# EAGLE design winglet (EAGLE 8.7.1)
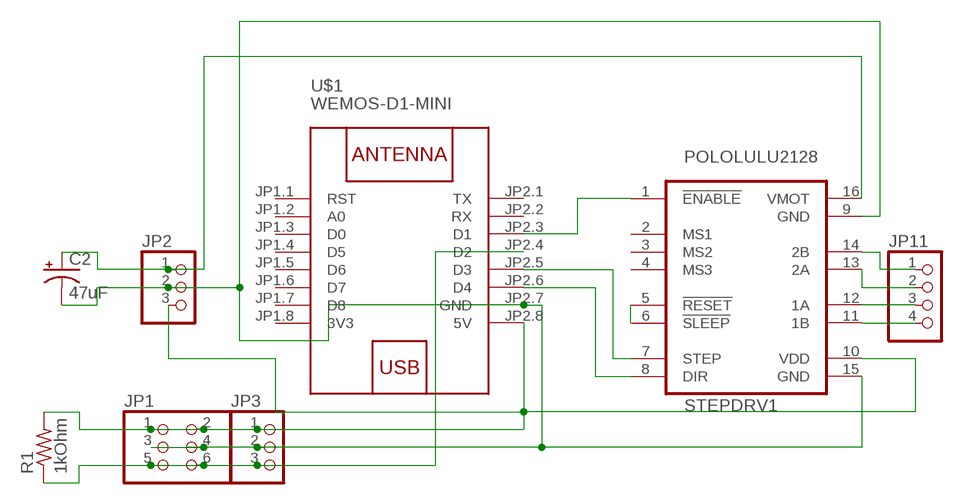
[diagram p0: schematic, sheet 1]

## Parts
C2  47uF  47UF-POLAR-PANASONIC_D-35V-20%  [PANASONIC_D]
JP1  PINHD-2X3  [2X03]
JP2  PINHD-1X3/90  [1X03/90]
JP3  PINHD-1X3  [1X03]
JP11  PINHD-1X4/90  [1X04/90]
R1  1kOhm  R-US_M1206  [M1206]
STEPDRV1  POLOLULU2128  [POLOLULU2128]
U$1  WEMOS-D1-MINI  [WEMOS-D1-MINI]

## Nets
N$1: JP1.1 JP1.2 JP2.3 JP3.1 R1.2 STEPDRV1.10(VDD) U$1.JP2.8(5V)
N$2: C2.- JP1.3 JP1.4 JP2.2 JP3.2 STEPDRV1.9(GND) STEPDRV1.15(GND) U$1.JP2.7(GND)
N$3: JP1.5 JP1.6 JP3.3 R1.1 U$1.JP2.4(D2)
N$4: STEPDRV1.5(!RESET) STEPDRV1.6(!SLEEP)
N$5: STEPDRV1.1(!ENABLE) U$1.JP2.3(D1)
N$6: STEPDRV1.7(STEP) U$1.JP2.5(D3)
N$7: C2.+ JP2.1 STEPDRV1.16(VMOT)
N$8: STEPDRV1.8(DIR) U$1.JP2.6(D4)
N$9: JP11.4 STEPDRV1.11(1B)
N$10: JP11.3 STEPDRV1.12(1A)
N$11: JP11.2 STEPDRV1.13(2A)
N$12: JP11.1 STEPDRV1.14(2B)
Unconnected: STEPDRV1.2(MS1) STEPDRV1.3(MS2) STEPDRV1.4(MS3) U$1.JP1.1(RST) U$1.JP1.2(A0) U$1.JP1.3(D0) U$1.JP1.4(D5) U$1.JP1.5(D6) U$1.JP1.6(D7) U$1.JP1.7(D8) U$1.JP2.1(TX) U$1.JP2.2(RX)

## Power pins joined to a net without a drawn wire
3V3: U$1.JP1.8(3V3)

## Library data of the parts
C2 = SparkFun-Capacitors:47UF-POLAR: 47µF polarized capacitors A capacitor is a passive two-terminal electrical component used to store electrical energy temporarily in an electric field.; PROD_ID: CAP-08478
JP1 = pinhead:PINHD-2X3: PIN HEADER
JP2 = pinhead:PINHD-1X3: PIN HEADER
JP3 = adafruit:PINHD-1X3: PIN HEADER
JP11 = pinhead:PINHD-1X4: PIN HEADER
R1 = adafruit:R-US_: RESISTOR, American symbol
STEPDRV1 = stepper_drivers_etc:POLOLULU2128
U$1 = diy-modules:WEMOS-D1-MINI: WEMOS D1 mini: Mini Wi-Fi Board based on ESP-8266 device More details can be found here: https://www.wemos.cc/product/d1-mini.html Click here to find device on ebay.com <http://www.ebay.com/sch/wemos+d1+mini+nodemcu>

## Board
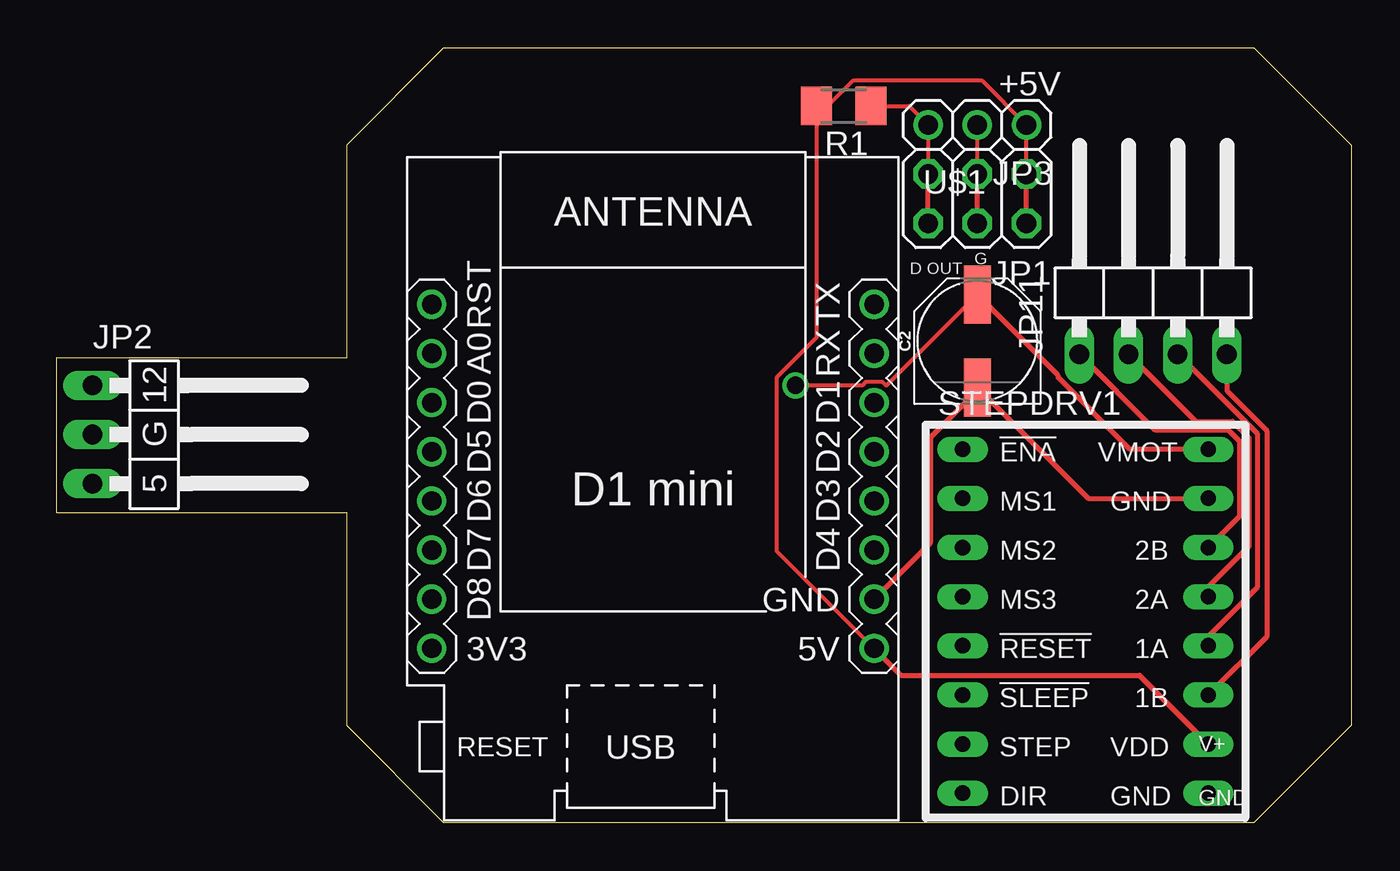
[diagram p1: board, top side]
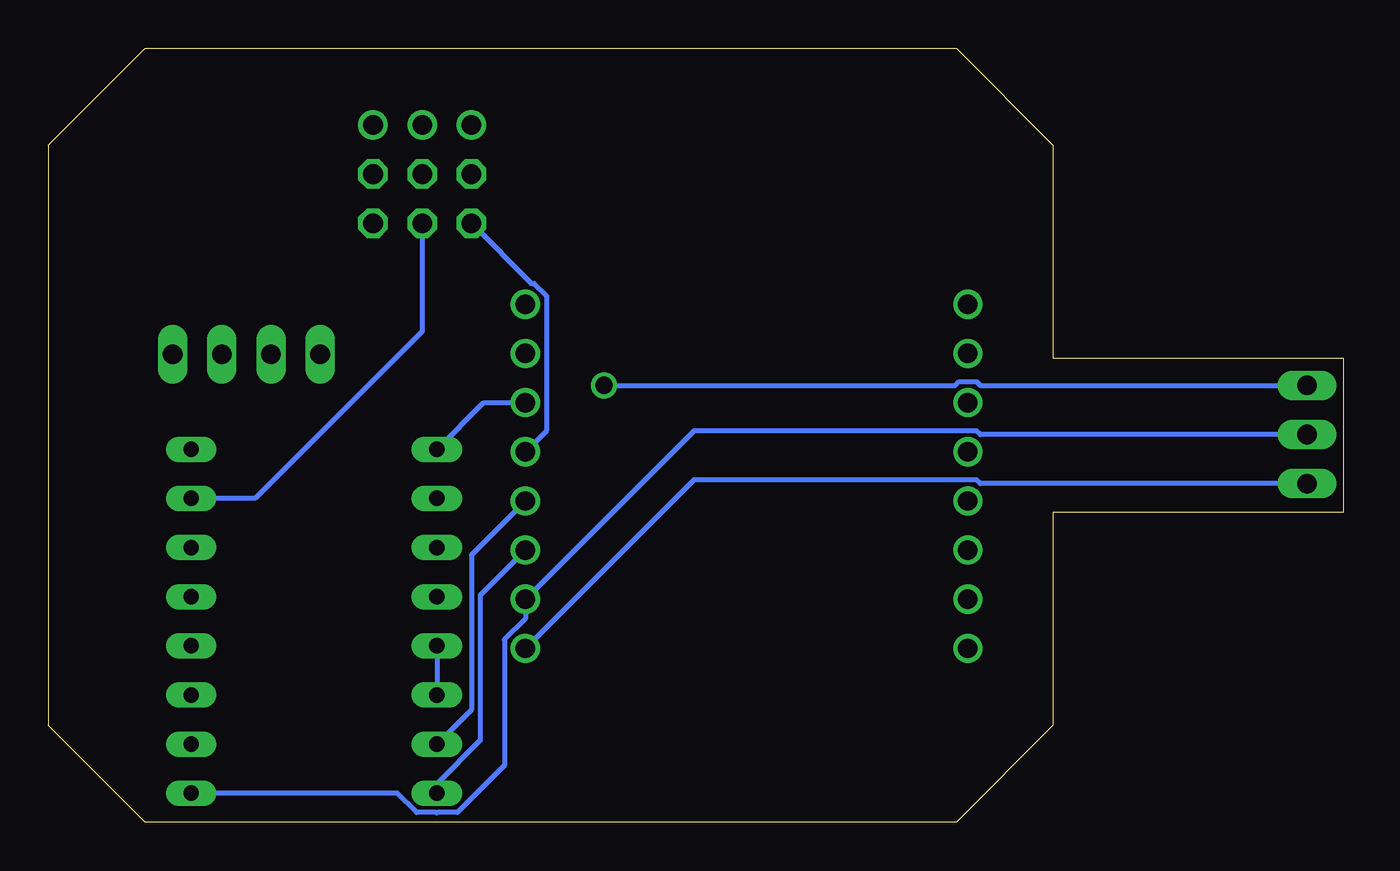
[diagram p2: board, bottom side, seen from below]

Size 66.92 x 40 mm. Coordinates in mm from the lower left corner, seen from the top.
Outline: 61.92,40 20,40 15,35 15,24 0,24 0,16 15,16 15,5 20,0 61.92,0 66.92,5 66.92,35 61.92,40
Copper layers (1*16): Top 0.035mm / dielectric 1.5mm / Bottom 0.035mm
Design rules "adafruit *": minimum track width 8mil, minimum drill 15.5mil, track to track 8mil, track to pad 8mil, pad to pad 8mil, via to via 8mil, smd to smd 8mil, copper to edge 10mil, drill to drill 8mil, minimum pad ring 10mil, minimum via ring 8mil, stop-mask expansion 2mil, vias tented up to drill 20mil, thermal gap 10mil

### Footprints (pad centres in the part's own frame; a part is rotated, then mirrored left to right if it is on the bottom)
PANASONIC_D = smd 3 x 1.4: + 2.4,0; - -2.4,0
2X03 = drill 1.016 octagon: 1 -2.54,-1.27; 2 -2.54,1.27; 3 0,-1.27; 4 0,1.27; 5 2.54,-1.27; 6 2.54,1.27
1X03/90 = drill 1.016 long: 1 -2.54,-3.81; 2 0,-3.81; 3 2.54,-3.81
1X03 = drill 1.016: 1 -2.54,0; 2 0,0; 3 2.54,0
1X04/90 = drill 1.016 long: 1 -3.81,-3.81; 2 -1.27,-3.81; 3 1.27,-3.81; 4 3.81,-3.81
M1206 = smd 1.6 x 2: 1 -1.4,0; 2 1.4,0
POLOLULU2128 = drill 0.8 long: 1 -7.62,7.62; 2 -7.62,5.08; 3 -7.62,2.54; 4 -7.62,0; 5 -7.62,-2.54; 6 -7.62,-5.08; 7 -7.62,-7.62; 8 -7.62,-10.16; 9 5.08,-10.16; 10 5.08,-7.62; 11 5.08,-5.08; 12 5.08,-2.54; 13 5.08,0; 14 5.08,2.54; 15 5.08,5.08; 16 5.08,7.62
WEMOS-D1-MINI = drill 1: JP1.1 -11.43,9.525; JP1.2 -11.43,6.985; JP1.3 -11.43,4.445; JP1.4 -11.43,1.905; JP1.5 -11.43,-0.635; JP1.6 -11.43,-3.175; JP1.7 -11.43,-5.715; JP1.8 -11.43,-8.255; JP2.1 11.43,9.525; JP2.2 11.43,6.985; JP2.3 11.43,4.445; JP2.4 11.43,1.905; JP2.5 11.43,-0.635; JP2.6 11.43,-3.175; JP2.7 11.43,-5.715; JP2.8 11.43,-8.255

### Placement (x,y rotation side)
C2  47.6,24.86 90 top
JP1  47.6,32.23 180 top
JP2  5.69,20.04 270 top
JP3  47.6,36.04 180 top
JP11  56.69,28 0 top
R1  40.69,37.02 180 top
STEPDRV1  54.46,11.66 0 top
U$1  30.84,17.24 0 top

### Tracks (layer width: path | path; a pad name or v marks a point on that pad's centre or on a via)
N$1
  Top 0.203: U$1.JP2.8 37.22,14.03 37.22,22.98 39.29,25.05 R1.2 39.86,37.02 41.17,38.32 47.86,38.32 JP3.1 JP1.1
  Top 0.254: JP1.2 JP1.1 | U$1.JP2.8 43.66,7.59 55.98,7.59 STEPDRV1.10
  Bottom 0.254: JP2.3 18.76,17.5 18.96,17.69 33.56,17.69 U$1.JP2.8
N$2
  Top 0.203: JP1.3 JP3.2
  Top 0.254: JP1.4 JP1.3 | C2.- 47.67,22.39 | 47.67,22.39 53.33,16.74 STEPDRV1.15 | U$1.JP2.7 45.2,14.46 45.2,19.92 47.67,22.39
  Bottom 0.254: JP2.2 18.76,20.04 18.96,20.23 33.56,20.23 U$1.JP2.7 42.27,10.52 43.35,9.44 43.35,2.94 45.78,0.51 46.81,0.51 46.84,0.48 46.87,0.51 47.9,0.51 48.89,1.5 STEPDRV1.9 | JP1.4 47.6,25.37 56.24,16.74 STEPDRV1.15
N$3
  Top 0.203: 45.06,34.05 JP1.5 JP3.3 44.08,37.02 R1.1
  Top 0.254: JP1.6 JP1.5
  Bottom 0.254: JP1.6 41.95,27.85 41.82,27.85 41.18,27.22 41.18,20.23 U$1.JP2.4
N$4
  Bottom 0.254: STEPDRV1.5 STEPDRV1.6
N$5
  Bottom 0.254: STEPDRV1.1 44.43,21.69 U$1.JP2.3
N$6
  Bottom 0.254: U$1.JP2.5 45.06,13.81 45.06,5.81 STEPDRV1.7
N$7  (via drill 0.9)
  Top 0.203: C2.+ 42.92,22.58 42.88,22.58 42.71,22.75 41.83,22.75 41.66,22.58 v38.2,22.58
  Top 0.254: C2.+ 51.79,23.08 51.79,22.98 55.49,19.28 STEPDRV1.16
  Bottom 0.254: v38.2,22.58 20.05,22.58 19.86,22.77 18.96,22.77 18.76,22.58 JP2.1
N$8
  Bottom 0.254: U$1.JP2.6 44.61,11.73 44.61,4.23 46.84,1.99 STEPDRV1.8
N$9
  Top 0.254: JP11.4 60.5,22.3 62.55,20.25 62.55,9.59 STEPDRV1.11
N$10
  Top 0.254: STEPDRV1.12 59.54,9.61 62.09,12.16 62.09,20.06 60.98,21.17 JP11.3
N$11
  Top 0.254: JP11.2 58.89,20.72 60.79,20.72 61.63,19.87 61.63,14.25 59.54,12.15 STEPDRV1.13
N$12
  Top 0.254: STEPDRV1.14 61.18,15.83 61.18,19.68 60.6,20.26 56.81,20.26 JP11.1

### Text on the board
tPlace: +5V | D OUT | G | 12 | G | 5 | V+ | GND